# Altium schematic sheet Top.SchDoc
size A; SheetNumber: 1; SheetTotal: 5
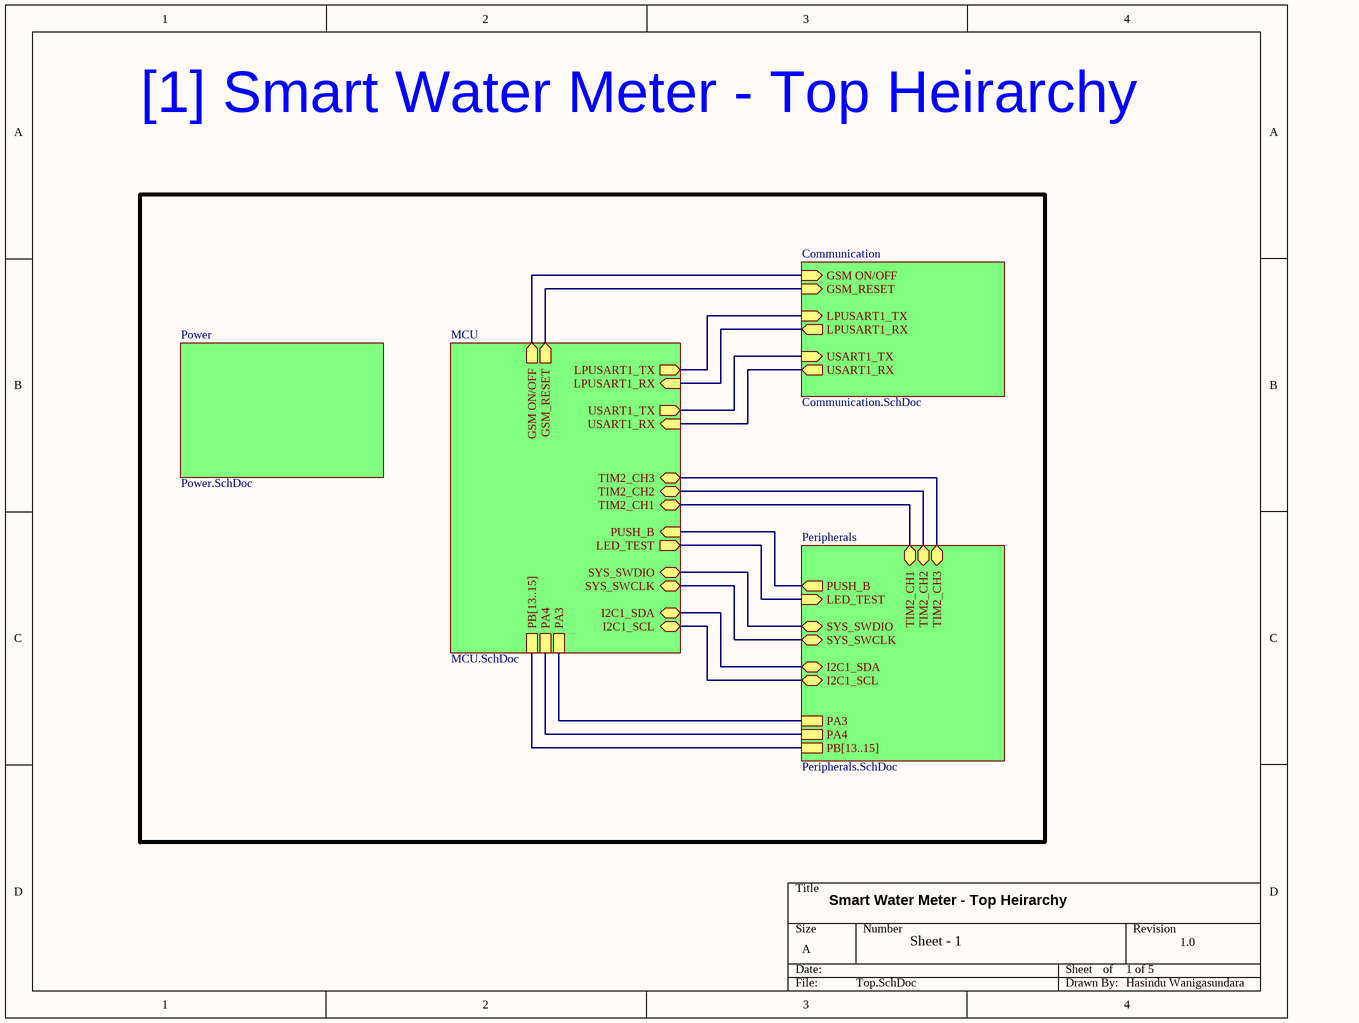
[diagram p0: Top.SchDoc]

## Sub-sheets
Communication = Communication.SchDoc: USART1_RX (out), USART1_TX (in), LPUSART1_RX (out), LPUSART1_TX (in), GSM_RESET (in), GSM ON/OFF (in)
MCU = MCU.SchDoc: SYS_SWDIO (bidir), SYS_SWCLK (bidir), PUSH_B (in), LED_TEST (out), LPUSART1_TX (out), LPUSART1_RX (in), USART1_TX (out), USART1_RX (in), GSM_RESET (out), GSM ON/OFF (out), I2C1_SCL (bidir), I2C1_SDA (bidir), PA3, PA4, PB[13..15], TIM2_CH1 (bidir), TIM2_CH2 (bidir), TIM2_CH3 (bidir)
Peripherals = Peripherals.SchDoc: SYS_SWDIO (bidir), SYS_SWCLK (bidir), PUSH_B (out), LED_TEST (in), I2C1_SCL (bidir), PA3, PA4, I2C1_SDA (bidir), PB[13..15], TIM2_CH1 (bidir), TIM2_CH2 (bidir), TIM2_CH3 (bidir)
Power = Power.SchDoc: no entries

## Nets
(unnamed): sheet Communication/USART1_RX, sheet MCU/USART1_RX
(unnamed): sheet Communication/USART1_TX, sheet MCU/USART1_TX
(unnamed): sheet Communication/LPUSART1_RX, sheet MCU/LPUSART1_RX
(unnamed): sheet Communication/LPUSART1_TX, sheet MCU/LPUSART1_TX
(unnamed): sheet Communication/GSM_RESET, sheet MCU/GSM_RESET
(unnamed): sheet Communication/GSM ON/OFF, sheet MCU/GSM ON/OFF
(unnamed): sheet MCU/SYS_SWDIO, sheet Peripherals/SYS_SWDIO
(unnamed): sheet MCU/SYS_SWCLK, sheet Peripherals/SYS_SWCLK
(unnamed): sheet MCU/PUSH_B, sheet Peripherals/PUSH_B
(unnamed): sheet MCU/LED_TEST, sheet Peripherals/LED_TEST
(unnamed): sheet MCU/I2C1_SCL, sheet Peripherals/I2C1_SCL
(unnamed): sheet MCU/I2C1_SDA, sheet Peripherals/I2C1_SDA
(unnamed): sheet MCU/PA3, sheet Peripherals/PA3
(unnamed): sheet MCU/PA4, sheet Peripherals/PA4
(unnamed): sheet MCU/TIM2_CH1, sheet Peripherals/TIM2_CH1
(unnamed): sheet MCU/TIM2_CH2, sheet Peripherals/TIM2_CH2
(unnamed): sheet MCU/TIM2_CH3, sheet Peripherals/TIM2_CH3

## Buses and harness runs
bus sheet MCU/PB[13..15] = sheet Peripherals/PB[13..15]

## Notes on the sheet
- [1] Smart Water Meter - Top Heirarchy
- Smart Water Meter - Top Heirarchy
- Sheet - 1
- 1 of 5
- 1.0
- Hasindu Wanigasundara